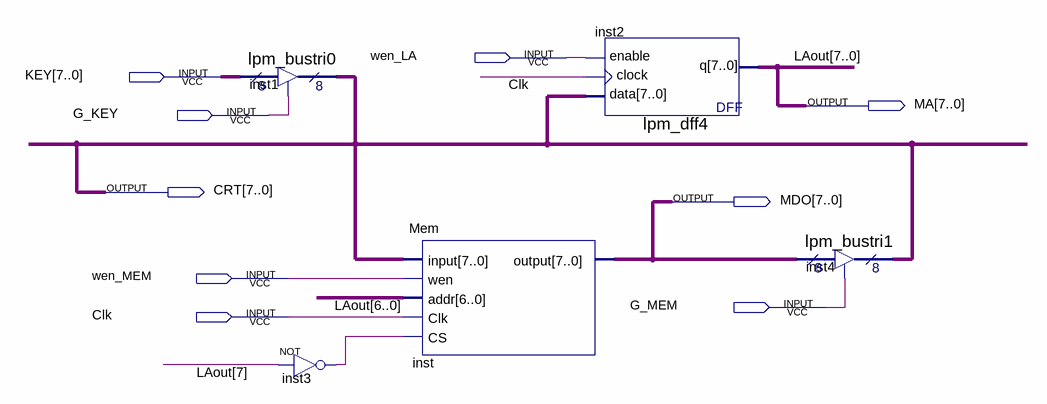
[diagram p0: schematic sheet]
// Quartus schematic Bus.bdf as structural Verilog: 5 symbols, 9 pins
module Bus (
  input  wen_LA,
  input  [7:0] KEY,
  input  G_KEY,
  input  wen_MEM,
  input  G_MEM,
  input  Clk,
  output [7:0] MA,
  output [7:0] CRT,
  output [7:0] MDO
);

  wire inst3_out;

  lpm_bustri0 inst1 (.enabledt(G_KEY), .data(KEY), .tridata(CRT));
  not inst3 (inst3_out, MA[7]);
  Mem inst (.\input (CRT), .wen(wen_MEM), .addr(MA[6:0]), .Clk(Clk), .CS(inst3_out), .\output (MDO));
  lpm_dff4 inst2 (.data(CRT), .clock(Clk), .enable(wen_LA), .q(MA));
  lpm_bustri1 inst4 (.enabledt(G_MEM), .data(MDO), .tridata(CRT));

  // Other names for the same wires on the sheet: LAout[7:0] = MA
endmodule
